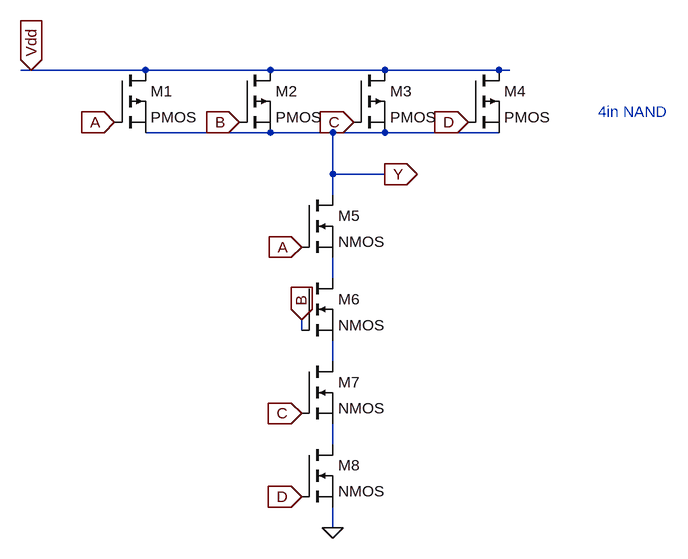
[diagram p0: schematic Draft1.asc]
Draft1.asc, the LTspice schematic file:
Version 4.1
SHEET 1 1308 864
WIRE 320 96 304 96
WIRE 496 96 320 96
WIRE 688 96 496 96
WIRE 864 96 688 96
WIRE 1040 96 864 96
WIRE 1056 96 1040 96
WIRE 688 192 496 192
WIRE 784 192 688 192
WIRE 864 192 784 192
WIRE 1040 192 864 192
WIRE 784 256 784 192
WIRE 864 256 784 256
WIRE 784 288 784 256
WIRE 784 416 784 384
WIRE 736 496 736 480
WIRE 784 544 784 512
WIRE 784 672 784 640
WIRE 784 800 784 768
FLAG 448 176 A
IOPIN 448 176 In
FLAG 736 368 A
IOPIN 736 368 In
FLAG 640 176 B
IOPIN 640 176 In
FLAG 736 480 B
IOPIN 736 480 In
FLAG 816 176 C
IOPIN 816 176 In
FLAG 736 624 C
IOPIN 736 624 In
FLAG 736 752 D
IOPIN 736 752 In
FLAG 992 176 D
IOPIN 992 176 In
FLAG 320 96 Vdd
IOPIN 320 96 In
FLAG 864 256 Y
IOPIN 864 256 Out
FLAG 784 800 0
SYMBOL pmos 448 96 R0
SYMATTR InstName M1
SYMBOL pmos 640 96 R0
SYMATTR InstName M2
SYMBOL pmos 816 96 R0
SYMATTR InstName M3
SYMBOL pmos 992 96 R0
SYMATTR InstName M4
SYMBOL nmos 736 288 R0
SYMATTR InstName M5
SYMBOL nmos 736 416 R0
SYMATTR InstName M6
SYMBOL nmos 736 544 R0
SYMATTR InstName M7
SYMBOL nmos 736 672 R0
SYMATTR InstName M8
TEXT 1192 160 Left 2 ;4in NAND

The netlist it stands for:
* Draft1.asc
M1 Vdd A Y Y PMOS
M2 Vdd B Y Y PMOS
M3 Vdd C Y Y PMOS
M4 Vdd D Y Y PMOS
M5 Y A N001 N001 NMOS
M6 N001 B N002 N002 NMOS
M7 N002 C N003 N003 NMOS
M8 N003 D 0 0 NMOS
.model NMOS NMOS
.model PMOS PMOS
.lib standard.mos
* 4in NAND
.backanno
.end